# EAGLE design Nixie_Power_Suppy_v3.0.1 (EAGLE 6.5.0)
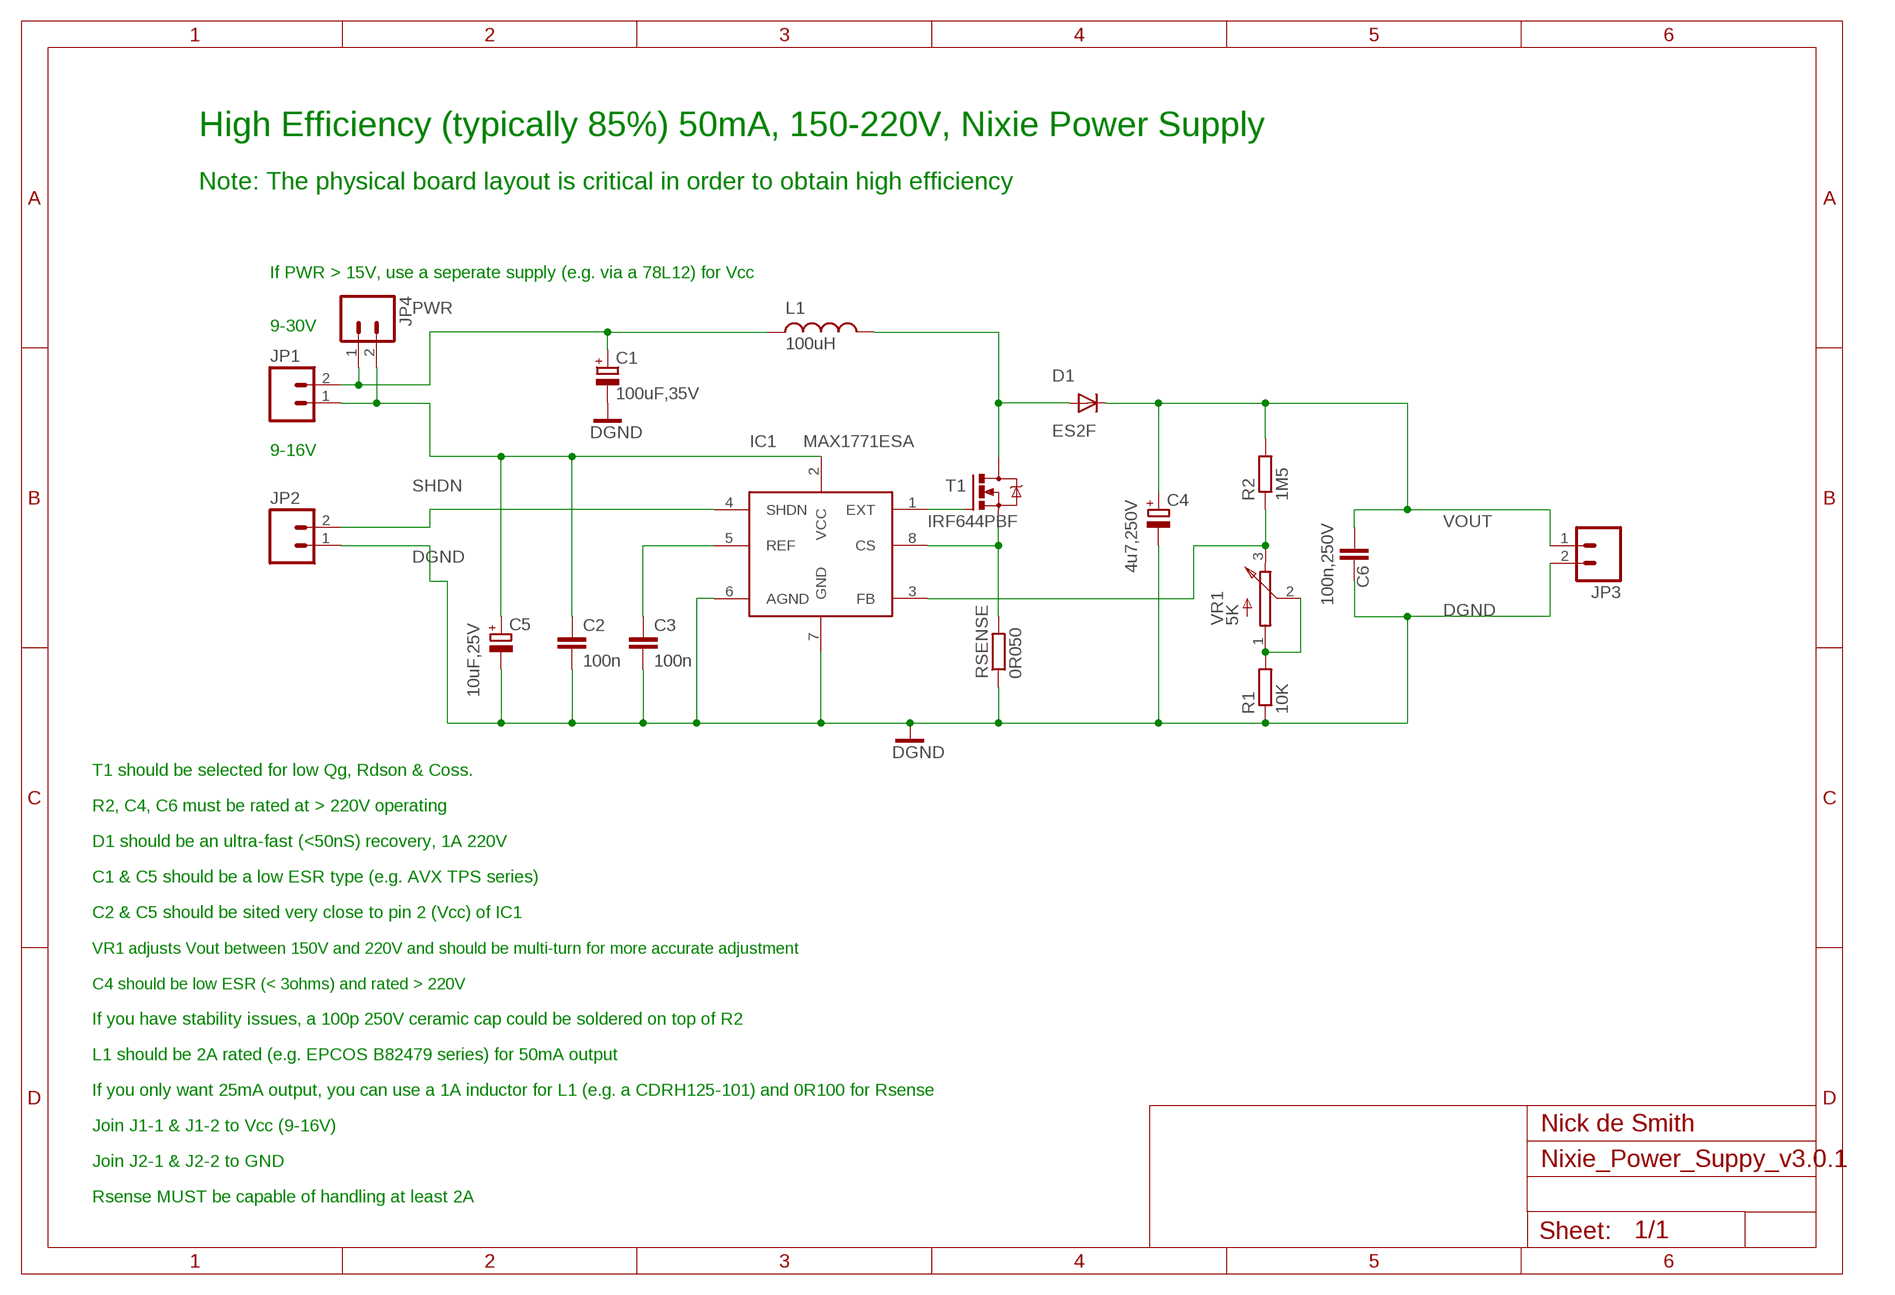
[diagram p0: schematic, sheet 1]

## Parts
C1  100uF,35V  C-POL-EU7343  [C-EIA-7343]
C2  100n  C-EUC0805  [C0805]
C3  100n  C-EUC0805  [C0805]
C4  4u7,250V  C-POL-EU-NICHICON-UJ-12  [NICHICON-UJ-12]
C5  10uF,25V  C-POL-EU7343  [C-EIA-7343]
C6  100n,250V  C-EU-2420  [C2420]
D1  ES2F  DIODE-SMC  [SMC]
IC1  MAX1771ESA  [SO-8]
JP1  M02PTH  [1X02]
JP2  M02PTH  [1X02]
JP3  M02PTH  [1X02]
JP4  M02PTH  [1X02]
L1  100uH  L-SMT-POWER-B82479  [L-B82479]
R1  10K  R-EU_R0805  [R0805]
R2  1M5  R-EU_R2512  [R2512]
RSENSE  0R050  R-EU_R2010  [R2010]
T1  IRF644PBF  IRF740  [TO220BV]
VR1  5K  TRIMPOT-3214W  [BOURNS-3214W]

## Nets
DGND [power]: C1.- C2.2 C3.2 C4.1(-) C5.- C6.P$2 IC1.6(AGND) IC1.7(GND) JP2.1 JP3.2 R1.1 RSENSE.1
EXT: IC1.1(EXT) T1.G
N$2: IC1.8(CS) RSENSE.2 T1.S
N$3: R1.2 VR1.1(A) VR1.2(W)
N$8: IC1.3(FB) R2.1 VR1.3(B)
N$15 [power]: D1.A L1.P$2 T1.D
N$17: C3.1 IC1.5(REF)
PWR [power]: C1.+ JP1.2 JP4.1 L1.P$1
SHDN: IC1.4(SHDN) JP2.2
VCC [power]: C2.1 C5.+ IC1.2(VCC) JP1.1 JP4.2
VOUT [power]: C4.2(+) C6.P$1 D1.C JP3.1 R2.2

## Notes on the sheet
- High Efficiency (typically 85%) 50mA, 150-220V, Nixie Power Supply
- Note: The physical board layout is critical in order to obtain high efficiency
- If PWR > 15V, use a seperate supply (e.g. via a 78L12) for Vcc
- 9-30V
- 9-16V
- T1 should be selected for low Qg, Rdson & Coss.
- R2, C4, C6 must be rated at > 220V operating
- D1 should be an ultra-fast (<50nS) recovery, 1A 220V
- C1 & C5 should be a low ESR type (e.g. AVX TPS series)
- C2 & C5 should be sited very close to pin 2 (Vcc) of IC1
- VR1 adjusts Vout between 150V and 220V and should be multi-turn for more accurate adjustment
- C4 should be low ESR (< 3ohms) and rated > 220V
- If you have stability issues, a 100p 250V ceramic cap could be soldered on top of R2
- L1 should be 2A rated (e.g. EPCOS B82479 series) for 50mA output
- If you only want 25mA output, you can use a 1A inductor for L1 (e.g. a CDRH125-101) and 0R100 for Rsense
- Join J1-1 & J1-2 to Vcc (9-16V) | Nick de Smith
- Join J2-1 & J2-2 to GND
- Rsense MUST be capable of handling at least 2A

## Library data of the parts
C1 C5 = nick:C-POL-EU7343: Capacitor, Tantalum, EU 7343 case, polarised
C2 C3 = rcl:C-EU: CAPACITOR, European symbol
C4 = nick:C-POL-EU: Capacitor, Tantalum, EU 7343 case, polarised
C6 = nick:C-EU
D1 = diode:DIODE-: DIODE
IC1 = nick:MAX1771
JP1-JP4 = SparkFun-Connectors:M02: Standard 2-pin 0.1" header. Use with - straight break away headers ( PRT-00116) - right angle break away headers (PRT-00553) - swiss pins (PRT-00743) - machine pins (PRT-00117) - female headers (PRT-00115) Molex polarized connector foot print use with: PRT-08233 with associated crimp pins and housings. 2.54_SCREWTERM for use with PRT-10571. 3.5mm Screw Terminal footprints for PRT-08084 5mm Screw Terminal footprints for use with PRT-08432
L1 = nick:L-SMT-POWER: SMT power inductors
R1 R2 RSENSE = rcl:R-EU_: RESISTOR, European symbol
T1 = transistor-power:IRF740: N-CHANNEL MOS FET
VR1 = nick:TRIMPOT

## Net classes
1 power: width 0.762 mm, clearance 0.508 mm

## Board
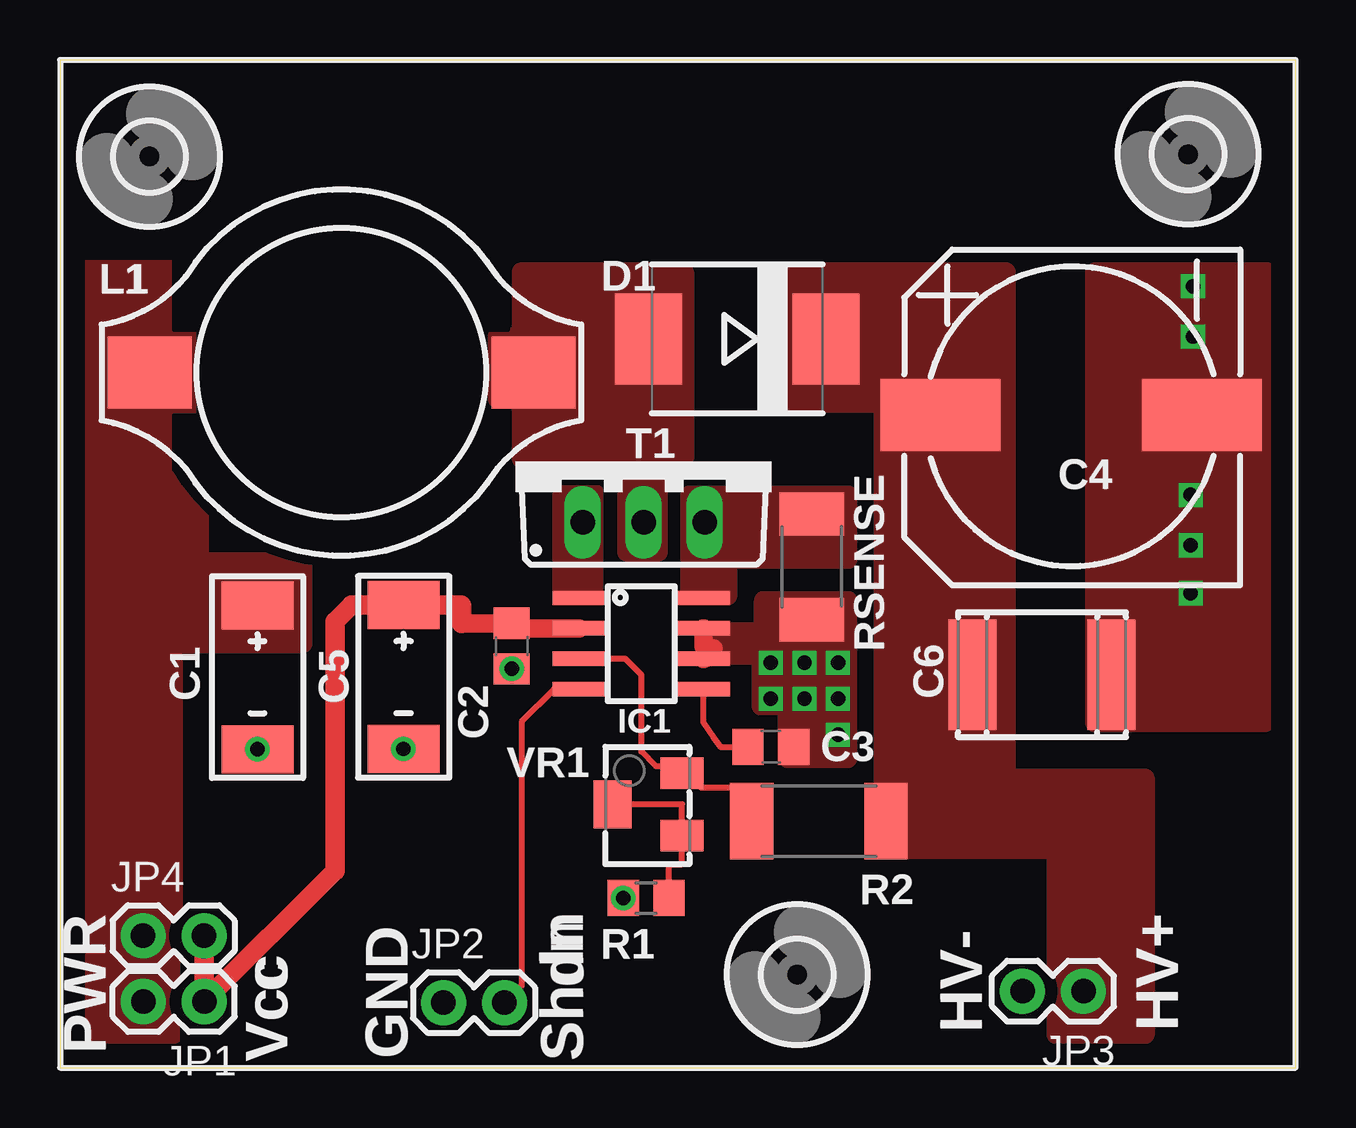
[diagram p1: board, top side]
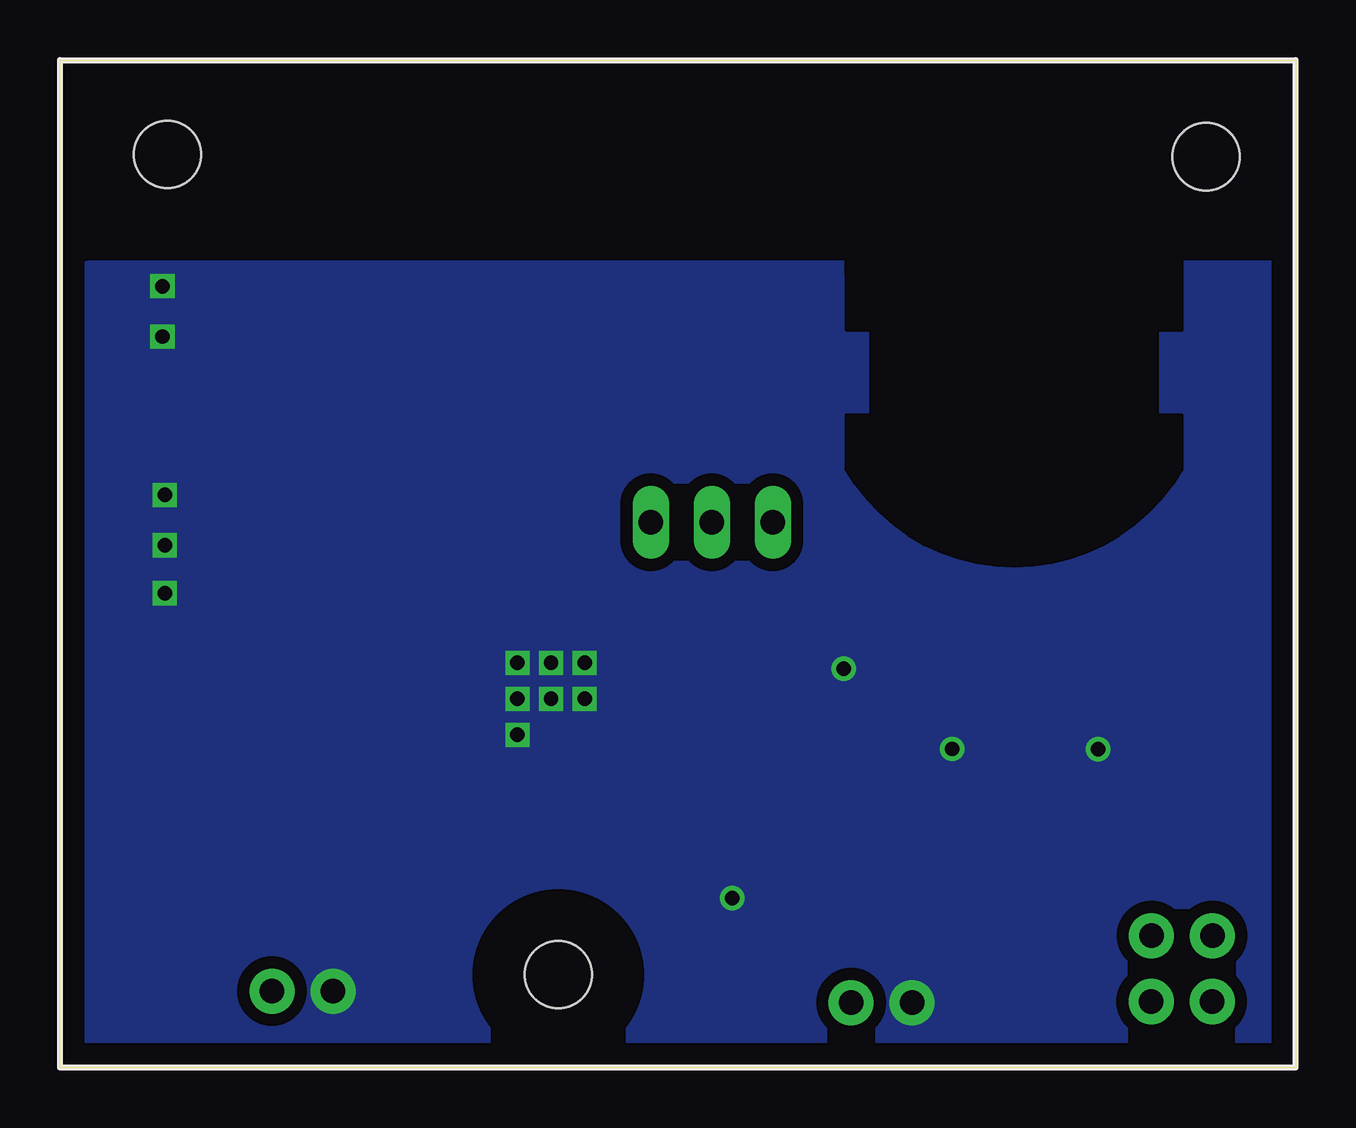
[diagram p2: board, bottom side, seen from below]

Size 51.5 x 42 mm. Coordinates in mm from the lower left corner, seen from the top.
Outline: 0,0 51.5,0 51.5,42 0,42 0,0
Copper layers (1*16): Top 0.035mm / dielectric 1.5mm / Bottom 0.035mm
Design rules "Olimex 10mils *": minimum track width 10mil, minimum drill 0.6mm, track to track 10mil, track to pad 10mil, pad to pad 10mil, via to via 10mil, smd to smd 10mil, copper to edge 40mil, drill to drill 10mil, minimum pad ring 10mil, minimum via ring 8mil, stop-mask expansion 0mil, vias tented up to drill 0mil, thermal gap 10mil

### Footprints (pad centres in the part's own frame; a part is rotated, then mirrored left to right if it is on the bottom)
C-EIA-7343 = smd 2 x 3: + -3,0; - 3,0
C0805 = smd 1.3 x 1.5: 1 -0.95,0; 2 0.95,0
NICHICON-UJ-12 = smd 3 x 5: 1 -2.4,-7.6; 2 -2.4,3.3
C2420 = smd 2 x 4.6: P$1 2.9,0; P$2 -2.9,0
SMC = smd 2.8 x 3.8: A 3.7,0; C -3.7,0
SO-8 = smd 0.6 x 2.2: 1 -1.905,-2.6; 2 -0.635,-2.6; 3 0.635,-2.6; 4 1.905,-2.6; 5 1.905,2.6; 6 0.635,2.6; 7 -0.635,2.6; 8 -1.905,2.6
1X02 = drill 1.016 pad 1.88: 1 0,0; 2 2.54,0
L-B82479 = smd 3.5 x 3: P$1 -8,0; P$2 8,0
R0805 = smd 1.3 x 1.5: 1 -0.95,0; 2 0.95,0
R2512 = smd 1.8 x 3.2: 1 -2.8,0; 2 2.8,0
R2010 = smd 1.8 x 2.7: 1 -2.2,0; 2 2.2,0
TO220BV = drill 1.016 long: D 0,-2.54; G -2.54,-2.54; S 2.54,-2.54
2,8 = hole 2.8: 0,0
BOURNS-3214W = smd 1.8 x 1.3: 1 1.4,-1.3; 3 1.4,1.3 | smd 1.6 x 2: 2 -1.5,0

### Placement (x,y rotation side)
C1  8.23,16.27 270 top
C2  18.83,17.57 270 top
C3  29.63,13.37 0 top
C4  39.99,29.6 90 top
C5  14.32,16.28 270 top
C6  40.93,16.37 180 top
D1  28.23,30.37 180 top
IC1  24.23,17.67 270 top
JP1  6.02,2.75 180 top
JP2  15.99,2.71 0 top
JP3  42.66,3.18 180 top
JP4  3.46,5.49 0 top
L1  11.73,28.97 0 top
R1  24.43,7.07 0 top
R2  31.63,10.27 0 top
RSENSE  31.33,20.87 90 top
T1  24.33,25.27 0 top
U$2  [2,8]  3.73,37.97 0 top
U$3  [2,8]  47.02,38.07 0 top
U$4  [2,8]  30.73,3.87 0 top
VR1  24.53,10.97 0 top

### Tracks (layer width: path | path; a pad name or v marks a point on that pad's centre or on a via)
DGND  (via drill 0.6, 0.6 pad 1.02)
  Top 0.762: IC1.6 26.93,17.07 27.23,17.17 | 27.23,17.47 26.93,17.47 26.83,17.57 IC1.7
  other vias: 29.63,16.87 31.03,15.37 32.43,13.87 32.43,15.37 32.43,16.87 31.03,16.87 29.63,15.37 47.13,23.87 47.13,21.77 47.13,19.77 23.48,7.07 14.32,13.28 8.23,13.27 18.83,16.62 47.23,30.47 47.23,32.57
  pour Bottom (isolate 0.01, rank 3, no thermals): 0.73,33.23 50.33,33.23 50.33,0.57 0.73,0.57
  pour Top (no thermals): 27.23,17.17 27.23,18.17 29.33,18.17 29.33,19.47 32.83,19.47 32.83,12.87 30.33,12.87 30.33,15.07 29.23,15.07 29.23,17.17
  pour Top (rank 2, no thermals): 43.13,33.17 50.33,33.17 50.23,14.37 43.13,14.37
EXT
  pour Top (no thermals): 20.73,24.07 22.43,24.07 22.43,19.47 20.73,19.47
N$2
  pour Top (no thermals): 26.26,19.67 26.26,23.87 32.83,23.87 32.83,21.17 27.83,21.17 27.83,19.67
N$3
  Top 0.254: VR1.2 25.93,10.97 VR1.1 25.93,8.47 25.38,8.47 R1.2
N$8
  Top 0.254: IC1.3 23.57,17.04 24.23,16.37 24.23,13.17 24.83,12.57 25.93,12.57 VR1.3 26.73,11.67 28.03,11.67 R2.1
N$15
  pour Top (rank 2, no thermals): 19.23,30.47 19.23,33.17 26.03,33.17 26.03,25.37 24.93,25.37 24.93,21.47 23.63,21.47 23.63,25.37 19.23,25.37 19.23,27.87 18.23,27.87 18.23,30.47
N$17
  Top 0.254: C3.1 27.53,13.37 27.23,13.77 26.83,14.37 IC1.5
PWR
  pour Top (isolate 0.01, rank 2, no thermals): 4.73,17.67 10.13,17.67 10.13,21.07 5.83,21.07 5.83,33.27 0.73,33.27 0.73,1.37 4.73,1.37
SHDN
  Top 0.254: IC1.4 20.59,15.77 19.25,14.43 19.25,3.43 JP2.2
VCC
  Top 0.762: 16.73,19.28 16.73,18.52 C2.1 18.83,18.3 IC1.2
  Top 0.813: 16.73,18.52 16.73,19.26 16.71,19.28 C5.+ 12.16,19.28 11.47,18.6 11.47,8.21 JP1.1 6,2.75 JP4.2
VOUT
  pour Top (isolate 0.01, rank 2, no thermals): 30.33,33.17 39.43,33.17 39.43,12.07 45.23,12.07 45.23,1.37 41.53,1.37 41.53,9.07 34.33,9.07 34.33,27.67 30.33,27.67

### Text on the board
tPlace: HV+ | PWR | HV- | Vcc | GND | Shdn
Measures: 0.000 | 0.146 | 1.839 | 1.655 | 1.512 | 1.508 | 0.154 | 0.000 | 0.000 | 0.001 | 0.000 | 0.001 | 0.000 | 0.000 | 1.209 | 2.026
_tsilk: L1 | D1 | T1 | C4 | RSENSE | C1 | C5 | C6 | C2 | IC1 | C3 | VR1 | R2 | R1 | HV+ | PWR | HV- | Vcc | GND | Shdn